# Altium schematic sheet ECEN403.SchDoc
size A; SheetNumber: 1; SheetTotal: 1
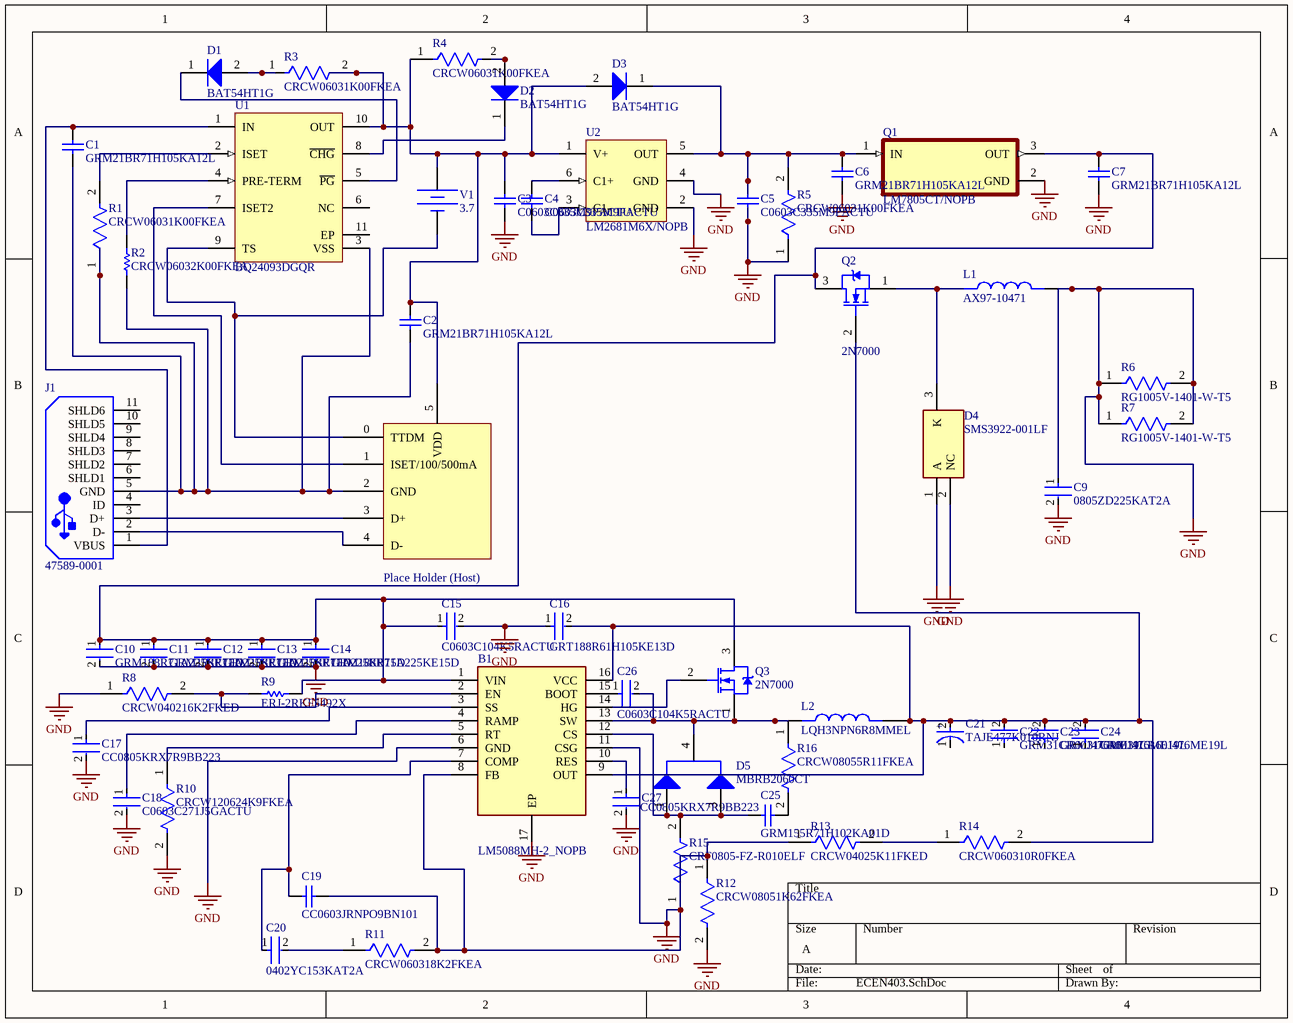
[diagram p0: ECEN403.SchDoc]

## Parts
?  Place Holder (Host)  [Placeholder]
B1  LM5088MH-2_NOPB  [SOP65P640X120-17N]
C1  GRM21BR71H105KA12L  [CAPC2013X135X45LL10T25]
C2  GRM21BR71H105KA12L  [CAPC2013X135X45LL10T25]
C3  C0603C335M9PACTU  [CAPC1608X90X35NL15T15]
C4  C0603C335M9PACTU  [CAPC1608X90X35NL15T15]
C5  C0603C335M9PACTU  [CAPC1608X90X35NL15T15]
C6  GRM21BR71H105KA12L  [CAPC2013X135X45LL10T25]
C7  GRM21BR71H105KA12L  [CAPC2013X135X45LL10T25]
C9  0805ZD225KAT2A  [FP-0805-L_2_01_0_2-W_1_25-IPC_B]
C10  GRM188R71A225KE15D  [FP-GRM188-0_1-e0_2_0_5-MFG]
C11  GRM188R71A225KE15D  [FP-GRM188-0_1-e0_2_0_5-MFG]
C12  GRM188R71A225KE15D  [FP-GRM188-0_1-e0_2_0_5-MFG]
C13  GRM188R71A225KE15D  [FP-GRM188-0_1-e0_2_0_5-MFG]
C14  GRM188R71A225KE15D  [FP-GRM188-0_1-e0_2_0_5-MFG]
C15  C0603C104K5RACTU  [FP-C0603C-CF-MFG]
C16  GRT188R61H105KE13D  [FP-GRT188-0_1-e0_2_0_5-IPC_B]
C17  CC0805KRX7R9BB223  [FP-CC0805-0_85-MFG]
C18  C0603C271J5GACTU  [FP-C0603C-CF-MFG]
C19  CC0603JRNPO9BN101  [CAPC1608X90X40ML10T20]
C20  0402YC153KAT2A  [FP-0402-L_1_0_1-W_0_5_0_1-IPC_B]
C21  TAJE477K010RNJ  [FP-TAJE-MFG]
C22  GRM31CR60J476ME19L  [FP-GRM31C-0_2-e0_3_0_8-IPC_C]
C23  GRM31CR60J476ME19L  [FP-GRM31C-0_2-e0_3_0_8-IPC_C]
C24  GRM31CR60J476ME19L  [FP-GRM31C-0_2-e0_3_0_8-IPC_C]
C25  GRM155R71H102KA01D  [CAPC1005X55X25ML5T10]
C26  C0603C104K5RACTU  [FP-C0603C-CF-MFG]
C27  CC0805KRX7R9BB223  [FP-CC0805-0_85-MFG]
D1  BAT54HT1G  [ONSC-SOD-323-2-477-02_V]
D2  BAT54HT1G  [ONSC-SOD-323-2-477-02_V]
D3  BAT54HT1G  [ONSC-SOD-323-2-477-02_V]
D4  SMS3922-001LF  [TRANS_BSS159NH6327XTSA2]
D5  MBRB2060CT  [ONSC-D2PAK-3-418B-04_V]
J1  47589-0001  [MOLX-47589-0001_V]
L1  AX97-10471  [IND_AX97-10471]
L2  LQH3NPN6R8MMEL  [IND_LQH3NPN6R8MMEL]
Q1  LM7805CT/NOPB  [TO254P1054X470X1955-3]
Q2  2N7000  [ONSC-TO-92-3-29-11]
Q3  2N7000  [ONSC-TO-92-3-29-11]
R1  CRCW06031K00FKEA  [FP-CRCW0603-e3-MFG]
R2  CRCW06032K00FKEA  [RESC1609X50X30ML10T20]
R3  CRCW06031K00FKEA  [FP-CRCW0603-e3-MFG]
R4  CRCW06031K00FKEA  [FP-CRCW0603-e3-MFG]
R5  CRCW06031K00FKEA  [FP-CRCW0603-e3-MFG]
R6  RG1005V-1401-W-T5  [FP-RG1005-IPC_A]
R7  RG1005V-1401-W-T5  [FP-RG1005-IPC_A]
R8  CRCW040216K2FKED  [FP-CRCW0402-e3-MFG]
R9  ERJ-2RKF5492X  [RESC1005X40X25ML05T05]
R10  CRCW120624K9FKEA  [FP-CRCW1206-e3-IPC_B]
R11  CRCW060318K2FKEA  [FP-CRCW0603-e3-IPC_C]
R12  CRCW08051K62FKEA  [FP-CRCW0805-e3-IPC_B]
R13  CRCW04025K11FKED  [FP-CRCW0402-e3-IPC_C]
R14  CRCW060310R0FKEA  [FP-CRCW0603-e3-IPC_A]
R15  CRF0805-FZ-R010ELF  [FP-CRF0805-MFG]
R16  CRCW08055R11FKEA  [FP-CRCW0805-e3-IPC_A]
U1  BQ24093DGQR  [DGQ0010D_M]
U2  LM2681M6X/NOPB  [DBV0006A_N]
V1  DC Magnitude: 3.7  (hidden comment: Constant Voltage Source)

## Nets
GND: B1.6(GND) B1.8(FB) B1.11(CSG) B1.17(EP) C3.1 C5.1 C6.1 C7.1 C9.1 C9.2 C10.2 C11.2 C12.2 C13.2 C14.2 C15.2 C16.1 C17.2 C18.2 C19.2 C27.2 D4.1(A) D4.2(NC) L1.2 Q1.2(GND) R5.1 R6.1 R6.2 R7.1 R7.2 R8.1 R10.2 R11.2 R12.1 R12.2 R13.1 R15.1 U2.2(GND) U2.4(GND)
Net?_0: ?.0(TTDM) U1.9(TS) V1.2
Net?_1: ?.1(ISET/100/500mA) U1.7(ISET2)
Net?_2: ?.2(GND) C1.1 C2.1 J1.5(GND) R1.1 R2.1 U1.3(VSS)
Net?_3: ?.3(D+) J1.3(D+)
Net?_4: ?.4(D-) J1.2(D-)
Net?_5: ?.5(VDD) C2.2 C3.2 D3.2(A) R3.2 R4.1 U1.10(OUT) U2.1(V+) V1.1
NetB1_1: B1.1(VIN) C7.2 C10.1 C11.1 C12.1 C13.1 C14.1 C15.1 Q1.3(OUT) Q2.3(D) Q3.3(D) R9.2
NetB1_2: B1.2(EN) R8.2 R9.1
NetB1_3: B1.3(SS) C17.1
NetB1_4: B1.4(RAMP) C18.1
NetB1_5: B1.5(RT) R10.1
NetB1_7: B1.7(COMP) C19.1 C20.1
NetB1_9: B1.9(OUT) B1.16(VCC) C16.2 C21.2(A) C22.2 C23.2 C24.2 L2.2 Q2.2(G) R14.2
NetB1_10: B1.10(RES) C27.1
NetB1_12: B1.12(CS) C25.1 D5.1(A1) D5.3(A2) R15.2
NetB1_13: B1.13(SW) C26.2 D5.4(K) L2.1 Q3.1(S) R16.1
NetB1_14: B1.14(HG) Q3.2(G)
NetB1_15: B1.15(BOOT) C26.1
NetC1_2: C1.2 J1.1(VBUS) U1.1(IN)
NetC4_1: C4.1 U2.3(C1-)
NetC4_2: C4.2 U2.6(C1+)
NetC5_2: C5.2 C6.2 D3.1(K) Q1.1(IN) R5.2 U2.5(OUT)
NetC20_2: C20.2 R11.1
NetC25_2: C25.2 R16.2
NetD1_1: D1.1(K) U1.5(~{PG})
NetD1_2: D1.2(A) R3.1
NetD2_1: D2.1(K) U1.8(~{CHG})
NetD2_2: D2.2(A) R4.2
NetD4_3: D4.3(K) L1.1 Q2.1(S)
NetR1_2: R1.2 U1.2(ISET)
NetR2_2: R2.2 U1.4(PRE-TERM)
NetR13_2: R13.2 R14.1

Not connected (* = marked no-connect by the designer): C21 1(C); C22 1; C23 1; C24 1; J1 4(ID) 6(SHLD1) 7(SHLD2) 8(SHLD3) 9(SHLD4) 10(SHLD5) 11(SHLD6); U1 6(NC) 11(EP)

## Notes on the sheet
- (in symbol CMP-04424-000243-1) +

## Library data of the parts
? = Component_1
B1 = LM5088MH-2_NOPB: Texas Instruments LM5088MH-2/NOPB, DC-DC Controller, 75 V Step-Down, Non-Synchronous, 1000 kHz, 16-Pin, TSSOP; Geometry.Height: 1.2mm; Mouser Part Number: 926-LM5088MH-2/NOPB; Mouser Price/Stock: https://www.mouser.co.uk/ProductDetail/Texas-Instruments/LM5088MH-2-NOPB?qs=QbsRYf82W3HnqvKQAYh%2FLg%3D%3D; Manufacturer_Name: Texas Instruments; Manufacturer_Part_Number: LM5088MH-2/NOPB; Datasheet Link: http://www.ti.com/lit/gpn/lm5088
C1 C2 C6 C7 = CMP-1036-04761-2: Manufacturer: Murata; Part Number: GRM21BR71H105KA12L
C3-C5 = CMP-1035-02770-2: Manufacturer: Kemet; Part Number: C0603C335M9PACTU
C9 = CMP-2000-05810-2: General Purpose Ceramic Capacitor, 0805, 2.2uF, 10%, X5R, 15%, 10V; Insulation Resistance: 500MR; Dissipation Factor: 5%; Termination: SMD/SMT; Length: 2.01mm; Lead Free: Lead Free; Voltage: 10V; Height: 1.4mm; Contact Plating: Tin; Dielectric: X5R; Voltage Rating (DC): 10V; REACH SVHC: No SVHC; Voltage Rating: 10V; Depth: 1.25mm; Min Operating Temperature: -55°C; Tolerance: 10%; Case Code (Metric): 2012; Max Operating Temperature: 85°C; Radiation Hardening: No; Dielectric Material: Ceramic; Packaging: Tape and Reel; Construction: Flat; Case Code (Imperial): 0805; RoHS Compliant: Yes; Package Quantity: 1; Capacitance: 2.2uF; Series: -; Size: 1.4mm; Number of Pins: 2; Width: 0.049inch; Mount: Surface Mount; Thickness: 0.055inch; Case/Package: 0805
C10-C14 = CMP-2006-02836-2: Chip Multilayer Ceramic Capacitors for General Purpose, 0603, 2.2uF, X7R, 15%, 10%, 10V; Case Code (Metric): 1608; Height: 0.8mm; Packaging: Cut Tape; Voltage: 10V; Lead Free: Lead Free; Min Operating Temperature: -55°C; Voltage Rating (DC): 10V; Max Operating Temperature: 125°C; Voltage Rating: 10V; Dielectric: X7R; Depth: 0.8mm; Case Code (Imperial): 0603; Termination: SMD/SMT; Case/Package: 0603; Number of Pins: 2; REACH SVHC: No SVHC; Mount: Surface Mount; Width: 0.031inch; Material: Ceramic; Capacitance: 2.2uF; Package Quantity: 1; Weight: 7.1E-05oz; Length: 1.6mm; Thickness: 0.035inch; Tolerance: 10%
C15 C26 = CMP-2006-03061-2: CAP CER 0.1UF 50V X7R 0603; Manufacturer: KEMET; Tolerance: 0.1; Temperature Coefficient: 30ppm/°C; Material: Ceramic; Automotive Grade: Grade 1; Value: 0.10 μF; Temperature: -55°C to +125°C; RoHS: TRUE; Temperature Range High: +125°C; Lead Free: Yes; Octopart: https://octopart.com/c0603c104k5ractu-kemet-139244; Digikey Description: CAP CER 0.1UF 50V X7R 0603; Category: Cap; Package: C0603C-CF; ComponentLink2Description: Datasheet; Temperature Range Low: -55°C; Device Class L1: Passive Components; Voltage Rating: 50 V; Automotive: Yes; Device Class L3: Ceramic Capacitors; ComponentLink2URL: https://api.kemet.com/component-edge/download/datasheet/C0603C100J5GACAUTO.pdf; Capacitance: 0.10 μF; Device Class L2: Capacitors; Manufacturer Part Number: C0603C104K5RACTU; Temperature Characteristic: X7R; Height: 0.87mm
C16 = CMP-06035-031856-1: Multi-Layer Ceramic Capacitor 1uF 50V X5R ±10% 0603 Paper T/R; Voltage Rating (DC): 50V; Voltage Rating: 50V; Min Operating Temperature: -55°C; Case Code (Metric): 1608; Thickness: 0.035inch; Width: 0.031inch; Capacitance: 1uF; Tolerance: 10%; Max Operating Temperature: 85°C; Dielectric: X5R; Case Code (Imperial): 0603; Case/Package: 0603; Length: 0.063inch; Packaging: Tape and Reel; Mount: Surface Mount; Ratings: AEC-Q200
C17 C27 = CMP-1036-04064-2: CAP CER 0.022UF 50V X7R 0805; Manufacturer: Yageo; Value: 22 nF; Material: Ceramic; Tolerance: 0.1; Temperature Range High: +85°C; Mouser Description: Multilayer Ceramic Capacitors MLCC - SMD/SMT 22nF 50V X7R 10%; Package: CC0805-0.85; Automotive: No; Temperature Characteristic: X7R; ComponentLink2Description: Datasheet; Manufacturer Part Number: CC0805KRX7R9BB223; Capacitance: 22 nF; Ipc Land Pattern Name: CAPC200125X85; Digikey Description: CAP CER 0.022UF 50V X7R 0805; Temperature: -30°C to +85°C; Height: 0.95mm; Temperature Range Low: -30°C; Category: Cap; Voltage Rating: 50 V; Device Class L3: Ceramic Capacitors; Device Class L1: Passive Components; Octopart: https://octopart.com/cc0805krx7r9bb223-yageo-39467761; Lead Free: Yes; Device Class L2: Capacitors; ComponentLink2URL: http://www.yageo.com/documents/recent/UPY-GPHC_Y5V_6.3V-to-50V_8.pdf; RoHS: TRUE; Footprint Url: http://www.yageo.com/exep/pages/download/literatures/UPY-C_GEN_24.pdf
C18 = CMP-2006-03310-2: CAP CER 270PF 50V C0G/NP0 0603; Manufacturer: KEMET; Automotive Grade: Grade 1; Temperature Characteristic: C0G; Temperature Coefficient: 30ppm/°C; Material: Ceramic; Tolerance: 0.05; Capacitance: 270 pF; Mouser Description: Multilayer Ceramic Capacitors MLCC - SMD/SMT 50volts 270pF C0G 5%; ComponentLink2Description: Datasheet; ComponentLink2URL: https://api.kemet.com/component-edge/download/datasheet/C0603C100J5GACAUTO.pdf; Temperature Range Low: -55°C; Digikey Description: CAP CER 270PF 50V C0G/NP0 0603; Category: Cap; Manufacturer Part Number: C0603C271J5GACTU; Voltage Rating: 50 V; Device Class L1: Passive Components; Temperature: -55°C to +125°C; Octopart: https://octopart.com/c0603c271j5gactu-kemet-136709; Package: C0603C-CF; Automotive: Yes; Temperature Range High: +125°C; Lead Free: Yes; Device Class L2: Capacitors; RoHS: TRUE; Height: 0.87mm; Value: 270 pF; Device Class L3: Ceramic Capacitors
C19 = CMP-2100-03594-1: Chip Capacitor, 100 pF, +/- 5%, 50 V, -55 to 125 degC, 0603 (1608 Metric), RoHS, Tape and Reel; Manufacturer: Yageo; Capacitance: 100pF; Voltage Rating (DC): 50V; Dielectric: C0G; Temperature Coefficient: 30ppm/degC; Insulation Resistance: 100GR; Datasheet Version: Rev. 14, 07/2016; Manufacturer URL: http://www.yageo.com/; Packaging: TapeandReel; Mount: SurfaceMount; RoHSCompliant: True; Package Reference: 0603; Tolerance: 5%; Max Operating Temperature: 125degC; Case Code (Imperial): 0603; Number of Pins: 2; Width: 0.8mm; Case Code (Metric): 1608; Voltage: 50V; REACH SVHC: Unknown; Package Description: 2-Pin Surface Mount Device, Body 1.6 x 0.8 mm; Composition: Ceramic; Lead Free: LeadFree; Min Operating Temperature: -55degC; Radiation Hardening: No; Depth: 0.8mm; Thickness: 0.035inch; Datasheet URL: http://www.yageo.com/documents/recent/UPY-GP_NP0_16V-to-50V_14.pdf; Termination: SMD/SMT; Package Quantity: 1; Length: 1.6mm; Voltage Rating: 50V; Height: 0.8mm; Case/Package: 0603
C20 = CMP-2008-02809-2: General Purpose Ceramic Capacitor, 0402, 15nF, 10%, X7R, 15%, 16V; RoHS Compliant: Yes; Thickness: 0.022inch; Voltage Rating: 16V; Package Quantity: 1; Depth: 0.5mm; Series: -; Number of Pins: 2; Mount: Surface Mount; REACH SVHC: No SVHC; Case Code (Metric): 1005; Packaging: Tape and Reel; Contact Plating: Tin; Capacitance: 15nF; Height: 0.56mm; Termination: SMD/SMT; Min Operating Temperature: -55°C; Length: 1mm; Case Code (Imperial): 0402; Radiation Hardening: No; Voltage: 16V; Tolerance: 10%; Voltage Rating (DC): 16V; Width: 0.5mm; Dielectric: X7R; Construction: Flat; Case/Package: 0402; Max Operating Temperature: 125°C; Lead Free: Lead Free
C21 = CMP-04424-000243-1: 470uF 10V  ±10% 500mΩ 2917  SMD Tantalum Capacitor; Leakage Current: 47uA; ESR (Equivalent Series Resistance): 500mR; Polarity: Polar; Construction: Flat; Width: 4.3mm; Mount: Surface Mount; Tolerance: 10%; Max Operating Temperature: 125°C; Min Operating Temperature: -55°C; Length: 7.3mm; Voltage: 10V; Dissipation Factor: 10%; REACH SVHC: No SVHC; Lead Free: Lead Free; Case/Package: 2917; Voltage Rating: 10V; Capacitance: 470uF; Series: TAJ; Height: 4.1mm; RoHS Compliant: Yes; Packaging: Tape and Reel; Voltage Rating (DC): 10V; Radiation Hardening: No; Dielectric Material: Tantalum; Number of Pins: 2; Depth: 4.3mm; Case Code (Metric): 7343; Case Code (Imperial): 2917; Termination: SMD/SMT; Lead Pitch: 4.4mm; Features: General Purpose; Height - Seated (Max): 0.169inch; Package Quantity: 1
C22-C24 = CMP-2000-06344-2: Chip Multilayer Ceramic Capacitors for General Purpose, 1206, 47uF, X5R, 15%, 20%, 6.3V; Package Quantity: 2000; Mount: Surface Mount; Length: 3.2mm; Thickness: 0.071inch; Lead Free: Lead Free; Tolerance: 20%; Width: 0.063inch; Depth: 1.6mm; Case/Package: 1206; Dielectric: X5R; Radiation Hardening: No; Packaging: Tape and Reel; Voltage Rating (DC): 6.3V; Termination: SMD/SMT; Height: 1.6mm; Max Operating Temperature: 85°C; Case Code (Metric): 3216; Case Code (Imperial): 1206; Voltage: 6.3V; Voltage Rating: 6.3V; Capacitance: 47uF; Min Operating Temperature: -55°C; Material: Ceramic; REACH SVHC: No SVHC
C25 = CMP-1662-00017-1: Chip Capacitor, 1 nF, +/- 10%, 50 V, -55 to 125 degC, 0402 (1005 Metric), RoHS, Tape and Reel; Case\/Package: 0402; Type (Capacitors): X7R; Voltage Rating (DC): 50 V; Capacitance: 1 nF; Width: 0.5 mm; Pins: 2; REACH SVHC: No SVHC; Length: 1 mm; Height: 0.5 mm; PackageDescription: 2-Pin Surface Mount Device, Body 1 x 0.5 mm; DatasheetVersion: 07/2016; Mount: Surface Mount; ComponentLink2Description: Datasheet; Tolerance: 10%; ComponentLink2URL: http://psearch.en.murata.com/capacitor/product/GRM155R71H102KA01%23.pdf; ComponentLink1URL: http://www.murata.com/; Case Code (Metric): 1005; Package Quantity: 10000; Min Operating Temperature: -55 degC; Max Operating Temperature: 125 degC; Voltage Rating: 50 V; ComponentLink1Description: Manufacturer URL; Packaging: Tape and Reel; Radiation Hardening: No; RoHSCompliant: true; PackageReference: 0402; Mounting Technology: Surface Mount; Case Code (Imperial): 0402
D1-D3 = CMP-1055-00462-1: Schottky Barrier Diode, 2-Pin SOD-323, Pb-Free, Tape and Reel; Manufacturer: On Semiconductor; Configuration: Single; trr Max (ns): 5; IFSM Max (A): 0.6; ComponentLink3URL: http://www.onsemi.com/pub_link/Collateral/477-02.PDF.1; PackageDescription: 2-Pin SOD, Body 1.7 x 1.25 mm; ComponentLink2URL: http://www.onsemi.cn/pub_link/Collateral/BAT54HT1-D.PDF; ComponentLink3Description: Package Specification; ComponentLink2Description: Datasheet; DatasheetVersion: Rev. 6; PackageReference: SOD-323-2-477-02; RoHS: TRUE; ComponentLink1URL: http://www.onsemi.com/; Packing: Tape and Reel; PartNumber: BAT54HT1G; Mounting Technology: Surface Mount; ComponentLink1Description: Manufacturer URL; PackageVersion: Rev. H, 03/2007
D4 = SMS3922-001LF: Schottky Diodes & Rectifiers Ls=1.5nH SOT-23 Single; Manufacturer_Name: Skyworks; Geometry.Height: 1.12mm; Mouser Part Number: 873-SMS3922-001LF; Mouser Price/Stock: https://www.mouser.co.uk/ProductDetail/Skyworks-Solutions-Inc/SMS3922-001LF?qs=WMHGlxXAKT974McT9yqRxw%3D%3D; Manufacturer_Part_Number: SMS3922-001LF; Datasheet Link: https://datasheet.datasheetarchive.com/originals/distributors/DKDS41/DSANUWW0028418.pdf
D5 = CMP-1055-00108-1: SWITCHMODE(TM) Power Rectifier, 3-Pin D2PAK, Tube; Manufacturer: On Semiconductor; Configuration: Common Cathode; IFSM Max (A): 150; ComponentLink3Description: Package Specification; PartNumber: MBRB2060CT; PackageVersion: Rev. K, 09/2008; PackageReference: D2PAK-3-418B-04; ComponentLink2Description: Datasheet; ComponentLink1Description: Manufacturer URL; DatasheetVersion: Rev. 9; ComponentLink2URL: http://www.onsemi.cn/pub_link/Collateral/MBRB2060CT-D.PDF; Packing: Tube; ComponentLink1URL: http://www.onsemi.com/; RoHS: FALSE; ComponentLink3URL: http://www.onsemi.com/pub_link/Collateral/418B-04.PDF; Mounting Technology: Surface Mount; PackageDescription: 3-Pin Flange Mount, Body 9.145 x 9.97 mm, Pitch 2.54 mm
J1 = CMP-2000-05610-1: Right Angle Female Type AB Micro USB Connector, 30 V, 1.8 A, -30 to 85 degC, RoHS, Tape and Reel; Number of Ports: 1Port; Current Rating: 1.8A; Brand: Molex; Connector Type: MicroUSBTypeABreceptacle; Number of Contacts: 5Contact; Voltage Rating: 30VAC; Color: Black; Product: MicroUSBTypeABConnectors; Package URL: http://www.molex.com/pdm_docs/sd/475890001_sd.pdf; Contact Plating: Gold; Datasheet URL: http://www.molex.com/webdocs/datasheets/pdf/en-us/0475890001_IO_CONNECTORS.pdf; Operating Temperature Range: -20Cto+85C; Termination Style: SMD/SMT; Mounting Angle: Right; Package Reference: 47589-0001; Gender: Female; Package Description: Micro USB Connector, Pitch 0.65 mm, 5 Positions, Body 7.5 x 5.6 mm; Mounting Technology: SurfaceMount; Contact Material: CopperAlloy; Packaging: Reel; RoHS: True; Standard: USB; Manufacturer URL: http://www.molex.com/; Manufacturer: Molex; Datasheet Version: 12/2016; Product Category: USBConnectors; Series: 47589
L1 = AX97-10471: AX97 Series 470 uH Â±20% Tolerance 0.12 A Unshielded Surface Mount Power Inductor; Package: None; Price: None; Value: *; MP: AX97-10471; Availability: Unavailable
L2 = LQH3NPN6R8MMEL: Inductor with Inductance: 6.8uH Tol. +/-20%, Package: 1212 (3030); MF: Murata; Price: None; Availability: In Stock; Package: NONSTANDARD; MP: LQH3NPN6R8MMEL; Value: *; SnapEDA_Link: https://www.snapeda.com/parts/LQH3NPN6R8MMEL/Murata/view-part/?ref=snap; Purchase-URL: https://pricing.snapeda.com/search/part/LQH3NPN6R8MMEL/?ref=eda; Check_prices: https://www.snapeda.com/parts/LQH3NPN6R8MMEL/Murata/view-part/?ref=eda
Q2 Q3 = CMP-1058-00936-1: Small Signal MOSFET, 200 mA, 60 V, N-Channel, 3-Pin TO-92, Bulk Box; Manufacturer: On Semiconductor; Ciss Typ (pF): 60; VGS(th) Max (V): 3; Crss Typ (pF): 5; Channel Polarity: N Channel; VGS Max (V): 20; Configuration: Single; PD Max (W): 0.35; Coss Typ (pF): 25; ID Max (A): 0.2; PackageVersion: Rev. AM; ComponentLink3URL: http://www.onsemi.cn/pub_link/Collateral/2N6426-D.PDF; ComponentLink2URL: http://www.onsemi.com/pub_link/Collateral/2N7000-D.PDF; DatasheetVersion: Rev. 8; Mounting Technology: Through Hole; V(BR)DSS Min (V): 60; PartNumber: 2N7000; PackageDescription: 3-Pin Transistor Outline, Body 4.825 x 3.685 mm, Pitch 1.27 mm; ComponentLink2Description: Datasheet; ComponentLink1URL: http://www.onsemi.com/; PackageReference: TO-92-3-29-11_AM_SL; Packing: Bulk Box; ComponentLink1Description: Manufacturer URL; Package Type: TO-92; ComponentLink3Description: Package Specification
R1 R3-R5 = CMP-1666-00003-5: RES Thick Film, 1kΩ, 1%, 0.1W, 100ppm/°C, 0603; Max Power Dissipation: 100mW; Voltage Rating: 75V; Resistance: 1kR; Max Operating Temperature: 155°C; Number of Pins: 2; Case Code (Imperial): 0603; Width: 0.033inch; Power Rating: 100mW; Number of Terminations: 2; Package Quantity: 10; Weight: 7.1E-05oz; Tolerance: 1%; Temperature Coefficient: 100ppm/°C; Military Standard: Not; Mount: Surface Mount; Voltage Rating (DC): 75V; Depth: 0.85mm; Composition: Thick Film; Radiation Hardening: No; Termination: SMD/SMT; Length: 1.55mm; Case Code (Metric): 1608; Contact Plating: Tin; Min Operating Temperature: -55°C; Packaging: Tape and Reel; Height: 0.45mm; Lead Free: Lead Free; Case/Package: 0603; Features: Automotive AEC-Q200
R2 = CMP-2000-03159-1: Manufacturer: Vishay Dale; Part Number: CRCW06032K00FKEA
R6 R7 = CMP-28537-002299-1: Automotive Metal Thin Film Chip Resistor, 0402, 1.4kΩ, 0.05%, 5ppm/°C, 0.0625W, 75V; Voltage Rating: 25V; Resistance: 1.4kR; Power Rating: 30mW; Max Power Dissipation: 63mW; Min Operating Temperature: -55°C; Termination: SMD/SMT; Case Code (Imperial): 0402; Length: 1mm; Width: 0.5mm; Temperature Coefficient: 5ppm/°C; RoHS Compliant: Yes; Tolerance: 0.05%; Lead Free: Lead Free; Packaging: Tape and Reel; Package Quantity: 5000; Series: RG; Height: 0.35mm; Case Code (Metric): 1005; Features: Automotive AEC-Q200; Resistor Type: Thin Film; Case/Package: 0402; Number of Terminations: 2; Voltage Rating (DC): 25V; Max Operating Temperature: 155°C
R8 = CMP-1011-00645-3: RES Thick Film, 16.2kΩ, 1%, 0.063W, 100ppm/°C, 0402; Power Rating: 63mW; Voltage Rating: 50V; Resistance: 16.2kR; Package Quantity: 10; Features: Automotive AEC-Q200; Case/Package: 0402; Composition: Thick Film; Number of Terminations: 2; Weight: 2.3E-05oz; Number of Pins: 2; Contact Plating: Tin; Case Code (Metric): 1005; Military Standard: Not; Radiation Hardening: No; Packaging: Tape and Reel; Length: 1mm; Depth: 0.5mm; Voltage Rating (DC): 50V; Case Code (Imperial): 0402; Lead Free: Lead Free; Height: 0.35mm; Termination: SMD/SMT; Tolerance: 1%; Width: 0.02inch; Max Operating Temperature: 155°C; Max Power Dissipation: 63mW; Temperature Coefficient: 100ppm/°C; Min Operating Temperature: -55°C
R9 = CMP-2002-00991-1: Manufacturer: Panasonic; Part Number: ERJ-2RKF5492X
R10 = CMP-2003-01990-2: RES Thick Film, 24.9kΩ, 1%, 0.25W, 100ppm/°C, 1206; Resistance: 24.9kR; Voltage Rating (DC): 200V; Power Rating: 250mW; Features: Automotive AEC-Q200; Military Standard: Not; Case/Package: 1206; Package Quantity: 10; Packaging: Tape and Reel; Contact Plating: Tin; Lead Free: Lead Free; Min Operating Temperature: -55°C; Temperature Coefficient: 100ppm/°C; Number of Terminations: 2; Length: 3.2mm; Case Code (Metric): 3216; Radiation Hardening: No; Height: 0.55mm; Termination: SMD/SMT; Width: 0.063inch; Composition: Thick Film; Max Operating Temperature: 155°C; Case Code (Imperial): 1206; Tolerance: 1%; Number of Pins: 2; Weight: 0.000353oz; Voltage Rating: 200V; Max Power Dissipation: 250mW; Depth: 1.6mm
R11 = CMP-2000-02961-2: RES Thick Film, 18.2kΩ, 1%, 0.1W, 100ppm/°C, 0603; Working Voltage: 75V; Resistance: 18.2kR; Max Power Dissipation: 100mW; Temperature Coefficient: 100ppm/°C; Width: 0.85mm; Termination: SMD/SMT; Voltage Rating (DC): 75V; Length: 1.55mm; Max Operating Temperature: 155°C; Radiation Hardening: No; Min Operating Temperature: -55°C; Composition: Thick Film; Contact Plating: Tin; Case Code (Metric): 1608; Tolerance: 1%; Power Rating: 100mW; Case/Package: 0603; Case Code (Imperial): 0603; Weight: 7.1E-05oz; Number of Terminations: 2; Package Quantity: 10; Packaging: Tape and Reel; Lead Free: Lead Free; Military Standard: Not; Voltage Rating: 75V; Height: 0.45mm; Features: Automotive AEC-Q200; Number of Pins: 2; Depth: 0.85mm
R12 = CMP-2001-04317-2: RES Thick Film, 1.62kΩ, 1%, 0.125W, 100ppm/°C, 0805; Max Power Dissipation: 125mW; Voltage Rating (DC): 150V; Resistance: 1.62kR; Height: 0.45mm; Number of Pins: 2; Weight: 0.000194oz; Width: 0.049inch; Case Code (Imperial): 0805; Contact Plating: Tin; Termination: SMD/SMT; Radiation Hardening: No; Length: 2mm; Features: Automotive AEC-Q200; Package Quantity: 10; Packaging: Tape and Reel; Number of Terminations: 2; Tolerance: 1%; Power Rating: 125mW; Max Operating Temperature: 155°C; Military Standard: Not; Depth: 1.25mm; Lead Free: Lead Free; Min Operating Temperature: -55°C; Composition: Thick Film; Voltage Rating: 150V; Case Code (Metric): 2012; Temperature Coefficient: 100ppm/°C; Case/Package: 0805
R13 = CMP-2002-00117-2: RES Thick Film, 5.11kΩ, 1%, 0.063W, 100ppm/°C, 0402; Power Rating: 63mW; Resistance: 5.11kR; Voltage Rating (DC): 50V; Lead Free: Lead Free; Depth: 0.5mm; Composition: Thick Film; Contact Plating: Tin; Mount: Surface Mount; Weight: 2.3E-05oz; Radiation Hardening: No; Packaging: Tape and Reel; Number of Pins: 2; Package Quantity: 10; Case Code (Imperial): 0402; Length: 1mm; Max Power Dissipation: 63mW; Termination: SMD/SMT; Height: 0.35mm; Temperature Coefficient: 100ppm/°C; Width: 0.02inch; Max Operating Temperature: 155°C; Case/Package: 0402; Number of Terminations: 2; Features: Automotive AEC-Q200; Min Operating Temperature: -55°C; Tolerance: 1%; Voltage Rating: 50V; Case Code (Metric): 1005; Military Standard: Not
R14 = CMP-2000-03845-2: RES Thick Film, 10Ω, 1%, 0.1W, 100ppm/°C, 0603; Resistance: 10R; Voltage Rating (DC): 75V; Power Rating: 100mW; Depth: 0.85mm; Height: 0.45mm; Package Quantity: 10; Temperature Coefficient: 100ppm/°C; Weight: 7.1E-05oz; Case Code (Metric): 1608; Number of Terminations: 2; Features: Automotive AEC-Q200; Termination: SMD/SMT; Lead Free: Lead Free; Mount: Surface Mount; Number of Pins: 2; Tolerance: 1%; Max Power Dissipation: 100mW; Width: 0.033inch; Contact Plating: Tin; Case Code (Imperial): 0603; Max Operating Temperature: 155°C; Min Operating Temperature: -55°C; Voltage Rating: 75V; Length: 1.55mm; Case/Package: 0603; Composition: Thick Film; Packaging: Tape and Reel; Military Standard: Not
R15 = CMP-07231-000006-1: RES 0.01 OHM 1% 1/2W 0805; Manufacturer: Bourns; Automotive Grade: Grade 0; Power Rating: 0.5W; Resistance: 10mΩ; Value: 10mΩ; Temperature Coefficient: 50ppm/°C; Category: Res; Ipc Land Pattern Name: RESC200125X60; Temperature: -55°C to +170°C; Package: CRF0805; Digikey Description: RES 0.01 OHM 1% 1/2W 0805; Device Class L2: Resistors; RoHS: TRUE; Lead Free: Yes; Mouser Description: Current Sense Resistors - SMD 0.010ohms 1% +/- 75PPM; Device Class L1: Passive Components; Automotive: Yes; ComponentLink2URL: https://www.bourns.com/docs/product-datasheets/crf.pdf?sfvrsn=616f91f1_24; Temperature Range Low: -55°C; Octopart: https://octopart.com/crf0805-fz-r010elf-bourns-75198941; Height: 0.8mm; Series: CRF; Temperature Range High: +170°C; Composition: Metal Element; Tolerance: 1%; ComponentLink2Description: Datasheet; Device Class L3: Chip SMD Resistors; Manufacturer Part Number: CRF0805-FZ-R010ELF
R16 = CMP-2001-04189-2: RES Thick Film, 5.11Ω, 1%, 0.125W, 100ppm/°C, 0805; Power Rating: 125mW; Voltage Rating (DC): 150V; Resistance: 5.11R; Width: 0.049inch; Mount: Surface Mount; Temperature Coefficient: 100ppm/°C; Case Code (Metric): 2012; Lead Free: Lead Free; Max Operating Temperature: 155°C; Voltage Rating: 150V; Number of Pins: 2; Height: 0.02inch; Military Standard: Not; Working Voltage: 150V; Features: Automotive AEC-Q200; Max Power Dissipation: 125mW; Min Operating Temperature: -55°C; Tolerance: 1%; Case/Package: 0805; Length: 2mm; Case Code (Imperial): 0805; Weight: 0.000194oz; Packaging: Tape and Reel; Contact Plating: Tin; Number of Terminations: 2; Composition: Thick Film; Depth: 1.25mm; Package Quantity: 10
U1 = CMP-0321-00904-2: 1 A, Single-Input, Single-Cell Li-Ion Battery Charger with Operation Over JEITA and 100 k ohm NTC, 4.5 V, -40 to 150 degC, 10-pin MSOP-PowerPAD (DGQ), Green (RoHS & no Sb/Br); Manufacturer: Texas Instruments; Lead Acid: N; SubFamily: Battery Charge Management; Vin(Min)(V): 4.5; PackageDescription: 10-Pin PowerPAD Plastic Small Outline 0.5 mm Pitch, Exposed Pad; Li-Polymer: N; Mounting Technology: Surface Mount; NiCd: N; PackageReference: DGQ0010D; Code_JEDEC: MO-187-BA-T; Over Voltage Protection: N; ComponentLink1URL: http://www.ti.com/general/docs/lit/getliterature.tsp?genericPartNumber=BQ24093&fileType=pdf; PartNumber: BQ24093DGQR; Eco-Plan: Green (RoHS & no Sb/Br); ComponentLink1Description: Datasheet; DatasheetVersion: SLUS968C; Li-Ion: N; NiMH: N; PackageVersion: revF, Nov-2011
U2 = CMP-0065-00073-3: Switched Capacitor Voltage Converter, 6-pin SOT-23, Pb-Free; Manufacturer: Texas Instruments; PackageTopMarking: S10A*XTT; PowerWise: N; CompType: Switch Caps; PackageDescription: Molded SOT-23, .115 x .063 x .040in Body, 6 Lead, .0375in in Pitch; Code_JEDEC: MO-178-AB; PackageReference: DBV0006A; ComponentLink1Description: Datasheet URL; PinCount: 6; Code_IPC: SOT26A-6; ComponentLink1URL: http://www.ti.com/general/docs/lit/getliterature.tsp?genericPartNumber=LM2681&fileType=pdf; RoHS: Y
V1 = Battery: SimulationGenericComponent: True
Q1 = LM7805CT/NOPB: Price: None; MP: LM7805CT/NOPB; Availability: Unavailable; Value: *; Package: None